# Altium schematic sheet KH-TYPE-C-16P.SchDoc
size A3; SheetNumber: 2; SheetTotal: 7
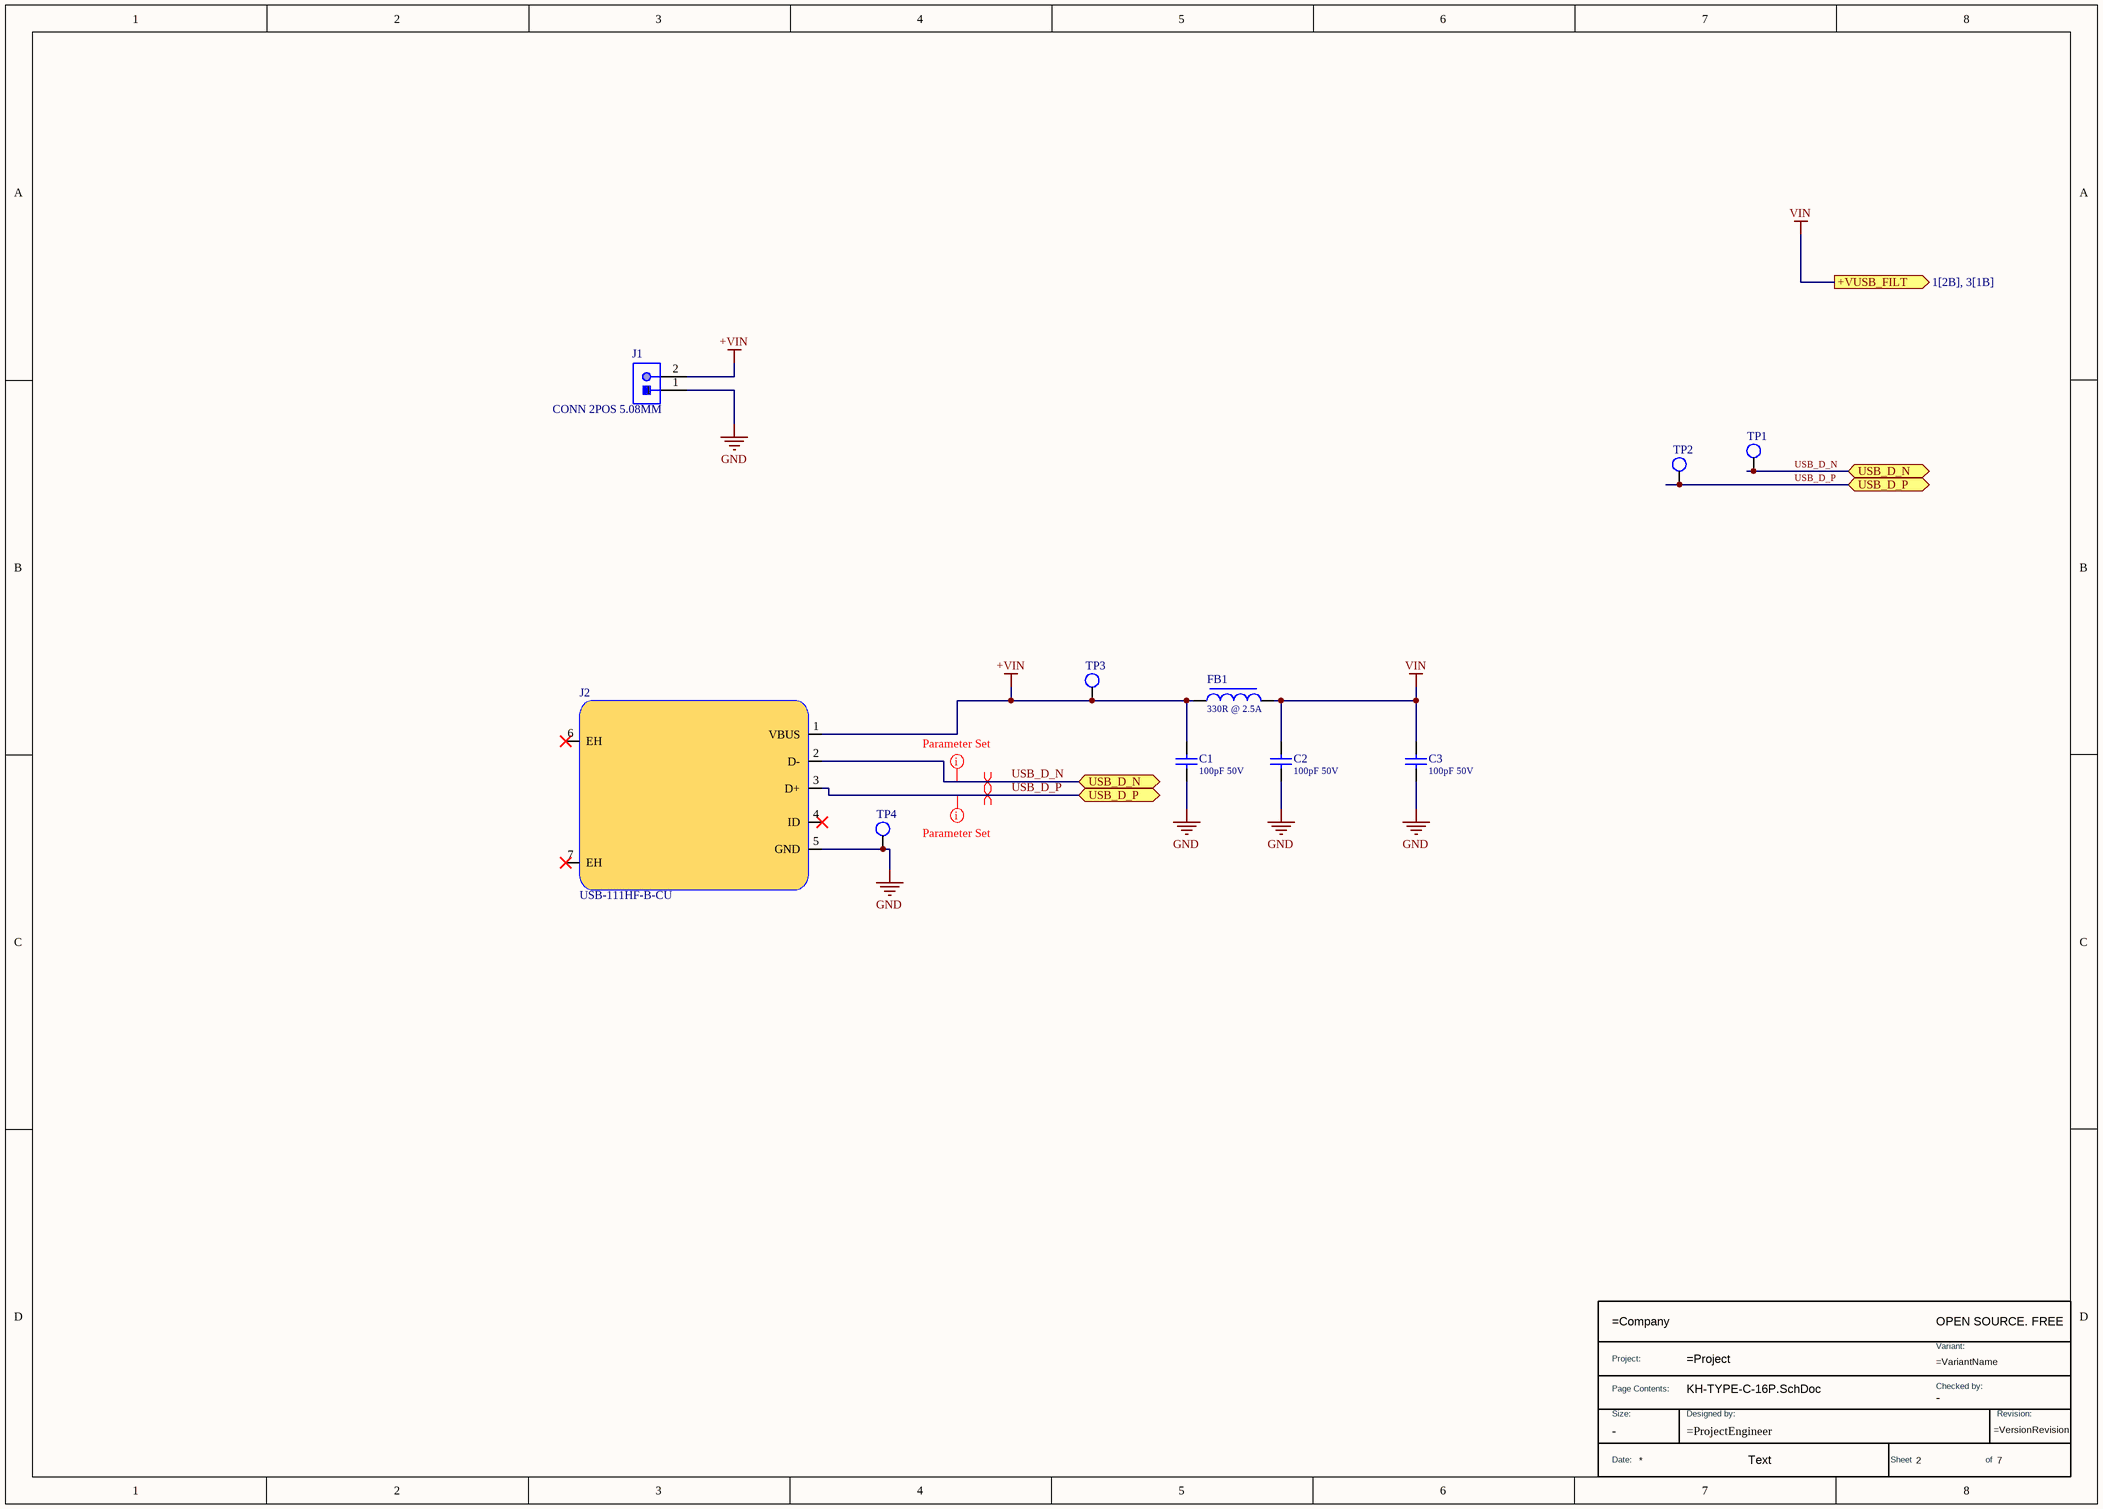
[diagram p0: KH-TYPE-C-16P.SchDoc]

## Parts
*  TitleBlock  (value not drawn)  (graphical)
C1  Valor: 100pF 50V  [CAP_0805]  (hidden comment: CC0805JRNPO9BN101)
C2  Valor: 100pF 50V  [CAP_0805]  (hidden comment: CC0805JRNPO9BN101)
C3  Valor: 100pF 50V  [CAP_0805]  (hidden comment: CC0805JRNPO9BN101)
FB1  Valor: 330R @ 2.5A  [IND_0805]  (hidden comment: MPZ2012S331AT000)
J1  Valor: CONN 2POS 5.08MM  [CONN TERM BLOCK 2POS 5.08MM]  (hidden comment: 796638-2)
J2  USB-111HF-B-CU  [USB-111HF-B-CU]
TP1  TEST_POINT_1.5MM  [TESTPOINT_1.5MM]  (value not drawn)  (no BOM)
TP2  TEST_POINT_1.5MM  [TESTPOINT_1.5MM]  (value not drawn)  (no BOM)
TP3  TEST_POINT_1.5MM  [TESTPOINT_1.5MM]  (value not drawn)  (no BOM)
TP4  TEST_POINT_1.5MM  [TESTPOINT_1.5MM]  (value not drawn)  (no BOM)

## Ports
+VUSB_FILT (out, see 1[2B], 3[1B]), USB_D_N (bidir, see 1[2B], 4[1B], 5[6B]), USB_D_P (bidir, see 1[2B], 4[1B], 5[6B])

## Nets
+VIN: C1.2 FB1.1 J1.2 J2.1(VBUS) TP3.1
GND: C1.1 C2.1 C3.1 J1.1 J2.5(GND) TP4.1
VIN: C2.2 C3.2 FB1.2 ; port +VUSB_FILT
USB_D_N: J2.2(D-) TP1.1 ; port USB_D_N
USB_D_P: J2.3(D+) TP2.1 ; port USB_D_P

Not connected (* = marked no-connect by the designer): J2 4(ID)* 6(EH)* 7(EH)*

## Layout directives
differential pair; differential pair class USB: USB_D_N, USB_D_P
net class USB: USB_D_N, USB_D_P

## Notes on the sheet
- Todas as informações e detalhes técnicos deste documento são de inteira propriedade da empresa V2COM,
- não poderão ser copiados, reduzidos ou cedidos a terceiros sem prévia autorização por escrito da mesma.
- Salvo em (D/M/A):
- Página:
- de
- Nome do Projeto:
- https://v2com.com/
- Ed.:
- Responsável:
- Nome da página:
- Rev.:
- Projetista:
- Obs.:
- Revisor:
- Arquivo:
- -
- (in symbol TitleBlock) OPEN SOURCE. FREE; Project:; Variant:; Page Contents:; Checked by:; Size:; Designed by:; Revision:; Date:; Text; Sheet; of

## Library data of the parts
* = TitleBlock: Standard Title Block; DWG NO: =ProjectEngineer; Size: -; Checked by: -
C1-C3 = CC0805JRNPO9BN101: CAP CER 100PF 50V C0G/NPO 0805; Manufacturer: YAGEO; Origem: OBDH_Ed02; Case/Package: 0805; Manufacturer Part Number: CC0805JRNPO9BN101; Observação: *
FB1 = MPZ2012S331AT000: FERRITE BEAD 330 OHM 0805 1LN; Manufacturer: TDK Corporation; Case/Package: 0805; Manufacturer Part Number: MPZ2012S331AT000; Origem: *; Observação: *
J1 = 796638-2: CONN TERM BLOCK HDR 2POS 90DEG 5.08MM; Manufacturer: TE Connectivity AMP Connectors; Origem: GT1021_Ed04r2; Manufacturer Part Number: 796638-2; Case/Package: PTH; Observação: *
J2 = USB-111HF-B-CU: Female 5 Micro-B Surface Mount SMD USB Connectors ROHS
TP1-TP4 = TEST_POINT_1.5MM: TEST_POINT; Origem: -; Case/Package: SMD; Manufacturer: -; Manufacturer Part Number: TEST_POINT; Observação: *; Valor: *